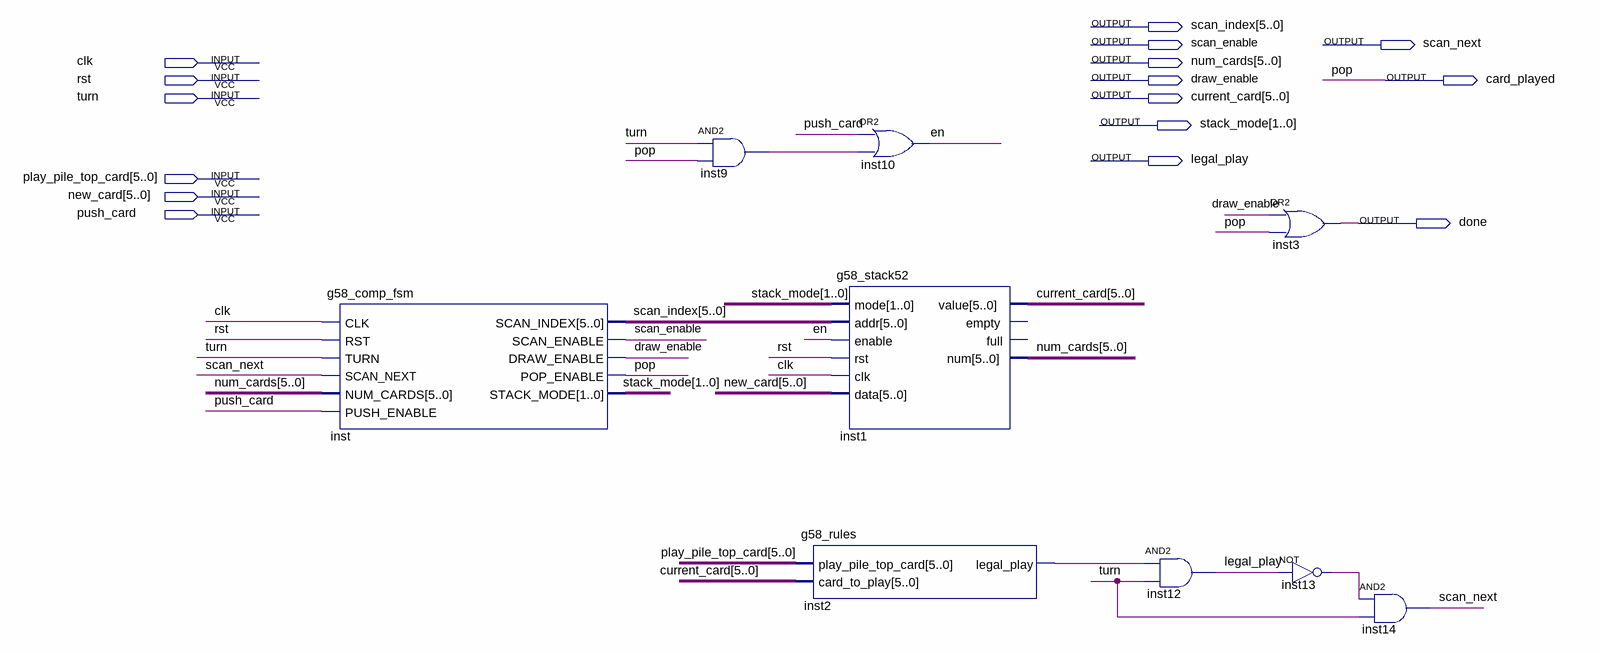
[diagram p0: schematic sheet]
// Quartus schematic g58_comp_player.bdf as structural Verilog: 9 symbols, 16 pins
module g58_comp_player (
  input  clk,
  input  rst,
  input  turn,
  input  [5:0] play_pile_top_card,
  input  [5:0] new_card,
  input  push_card,
  output [5:0] scan_index,
  output scan_enable,
  output scan_next,
  output [5:0] num_cards,
  output draw_enable,
  output card_played,
  output [5:0] current_card,
  output [1:0] stack_mode,
  output legal_play,
  output done
);

  wire en, inst2_legal_play, inst9_out, inst13_out;

  g58_comp_fsm inst (
    .CLK(clk), .RST(rst), .TURN(turn), .SCAN_NEXT(scan_next), .NUM_CARDS(num_cards), .PUSH_ENABLE(push_card),
    .SCAN_INDEX(scan_index), .SCAN_ENABLE(scan_enable), .DRAW_ENABLE(draw_enable), .POP_ENABLE(card_played),
    .STACK_MODE(stack_mode));
  and inst9 (inst9_out, turn, card_played);
  g58_stack52 inst1 (
    .mode(stack_mode), .addr(scan_index), .enable(en), .rst(rst), .clk(clk), .data(new_card),
    .value(current_card), .num(num_cards));  // open: empty, full
  g58_rules inst2 (.play_pile_top_card(play_pile_top_card), .card_to_play(current_card), .legal_play(inst2_legal_play));
  or inst10 (en, push_card, inst9_out);
  and inst12 (legal_play, inst2_legal_play, turn);
  or inst3 (done, draw_enable, card_played);
  not inst13 (inst13_out, legal_play);
  and inst14 (scan_next, inst13_out, turn);

  // Other names for the same wires on the sheet: pop = card_played
endmodule
